# EasyEDA Pro project SSRC v1.eprj, schematic Schematic1_1
Board Name: PCB2; Create Date: 2025-12-02; Page Name: P1; Project Name: SSRC v1; Schematic Name: Schematic1_1; Update Date: 2025-12-05; Company: EasyEDA.com; Page Size: A4; Version: V1.0
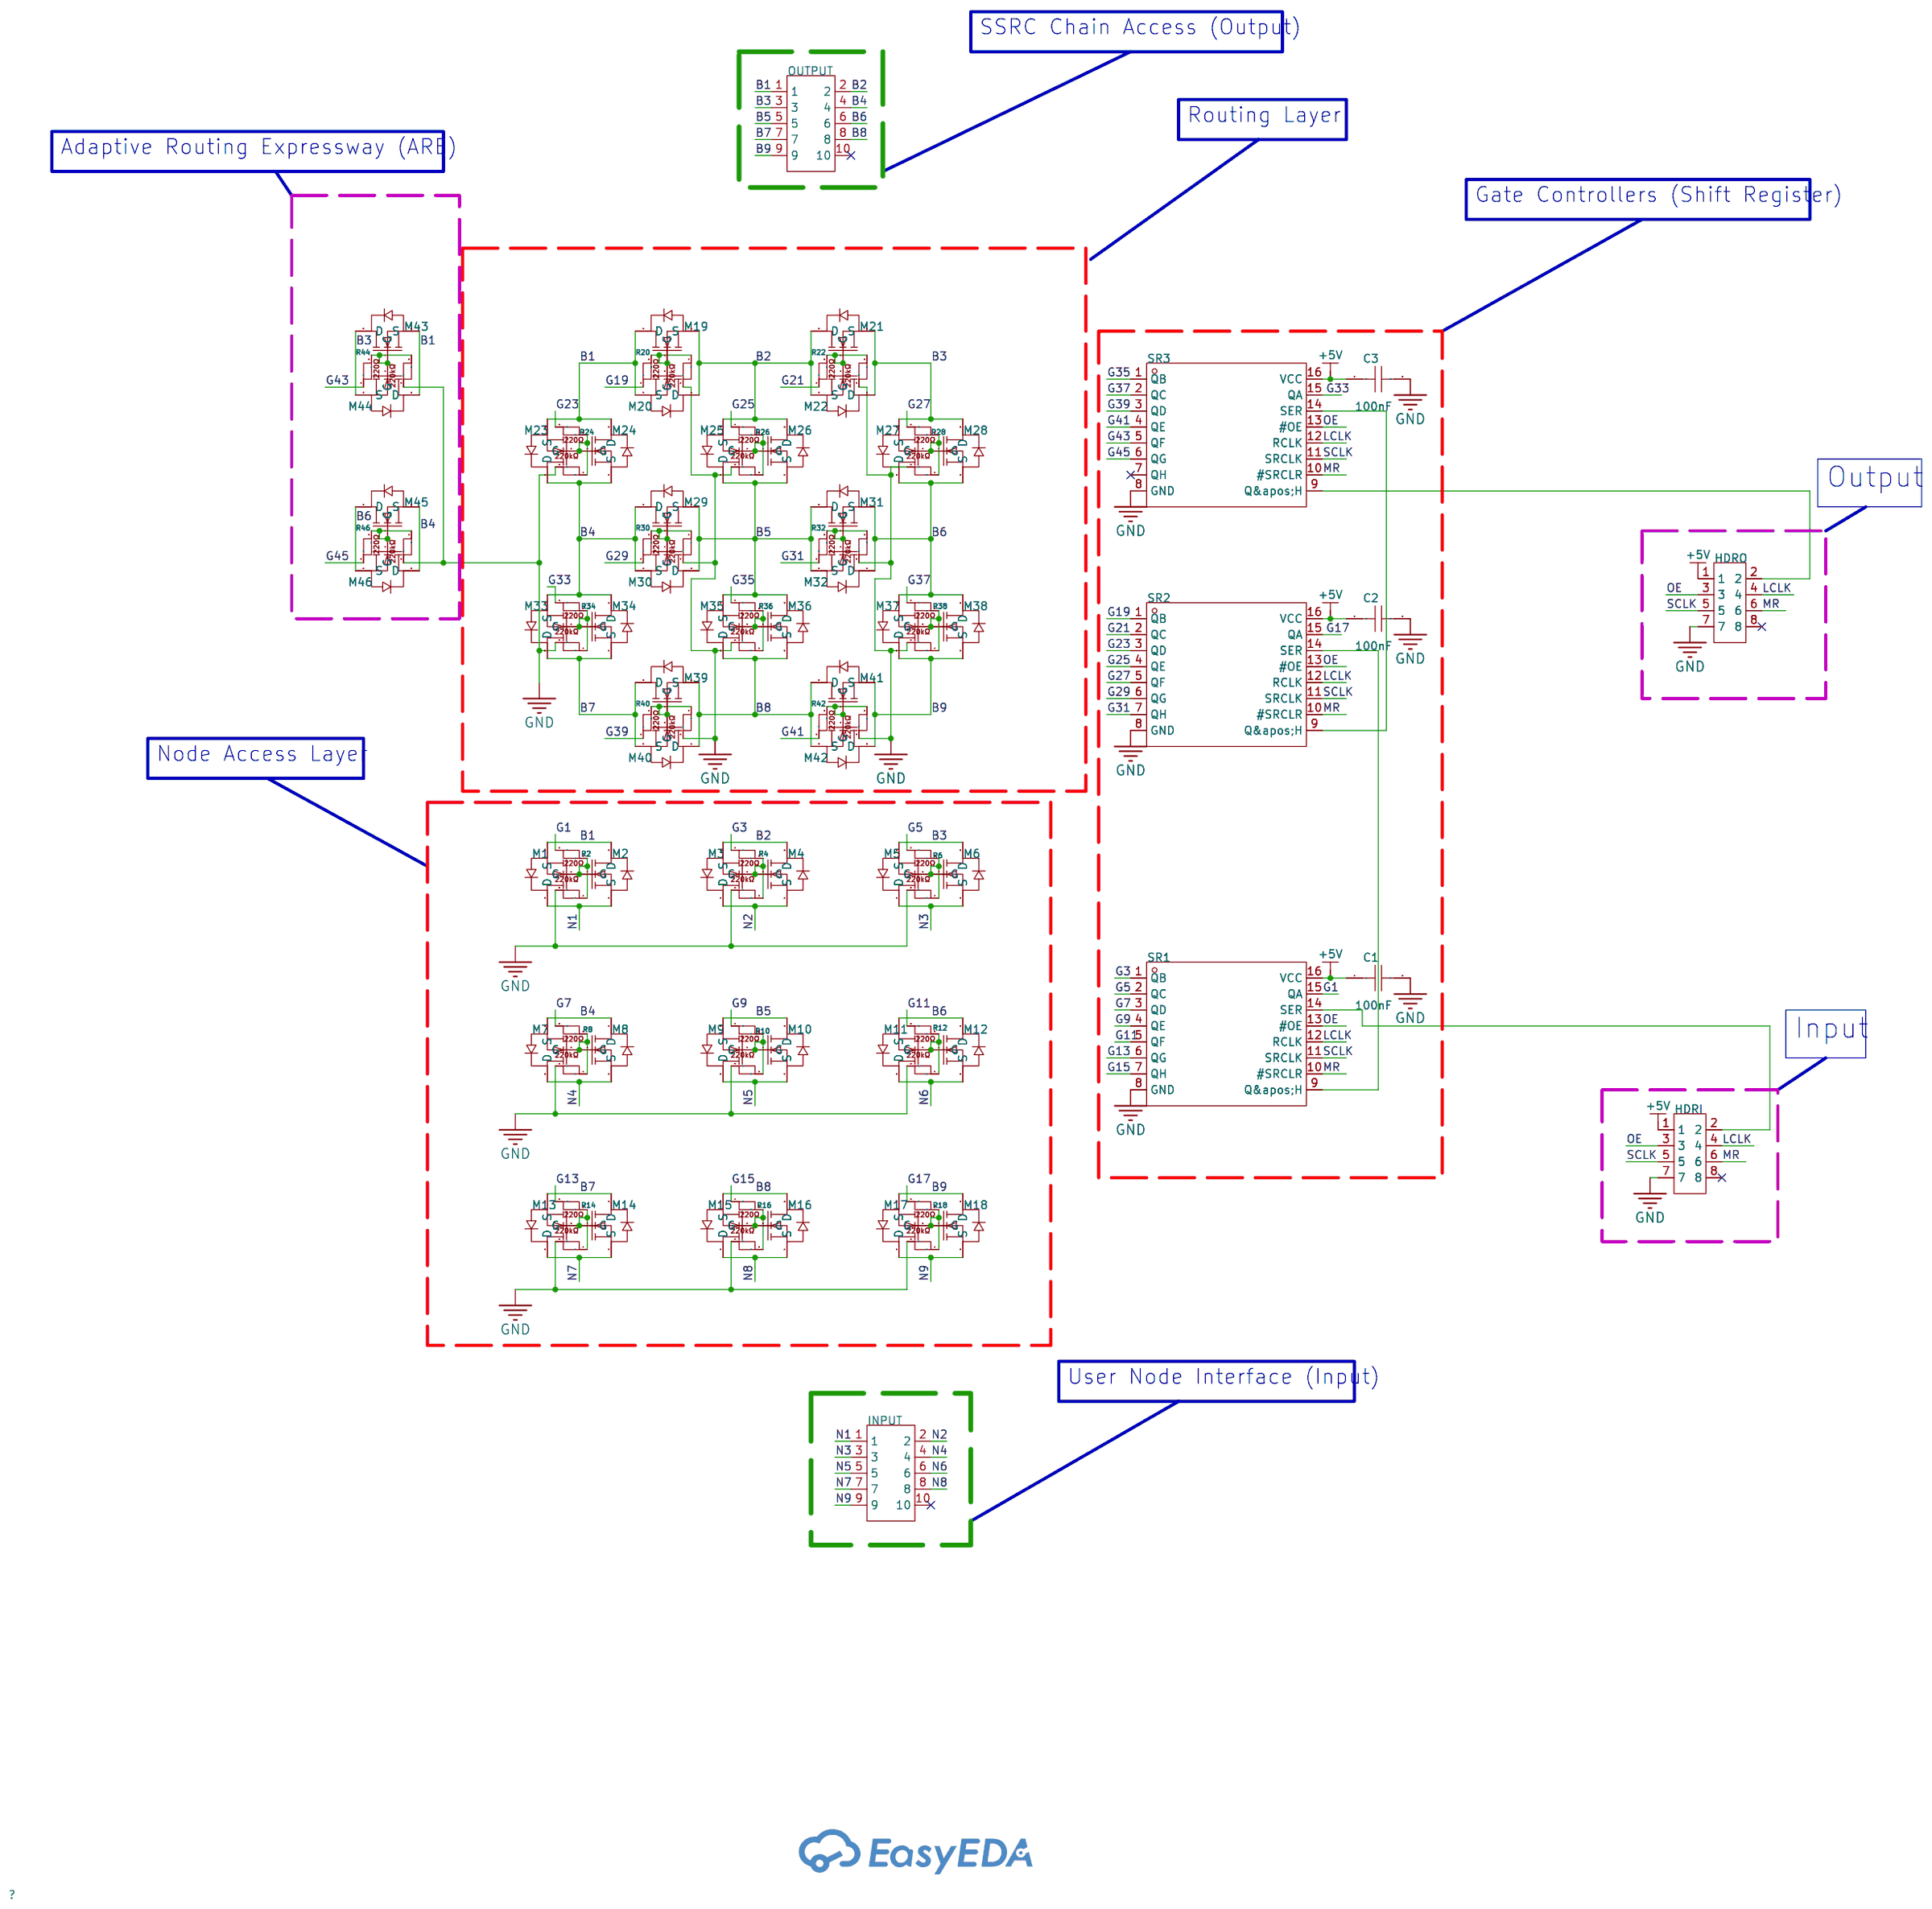
[diagram p1: schematic sheet]

## Parts
C1  100nF  [C0805]
C2  100nF  [C0805]
C3  100nF  [C0805]
HDRI  PZ254V-12-8P  [HDR-TH_8P-P2.54-V-M-R2-C4-S2.54]
HDRO  PZ254V-12-8P  [HDR-TH_8P-P2.54-V-M-R2-C4-S2.54]
INPUT  PZ254V-12-10P  [HDR-TH_10P-P2.54-V-M-R2-C5-S2.54]
M1  -  [SOT-23-3_L2.9-W1.3-P1.90-LS2.4-BR]
M2  -  [SOT-23-3_L2.9-W1.3-P1.90-LS2.4-BR]
M3  -  [SOT-23-3_L2.9-W1.3-P1.90-LS2.4-BR]
M4  -  [SOT-23-3_L2.9-W1.3-P1.90-LS2.4-BR]
M5  -  [SOT-23-3_L2.9-W1.3-P1.90-LS2.4-BR]
M6  -  [SOT-23-3_L2.9-W1.3-P1.90-LS2.4-BR]
M7  -  [SOT-23-3_L2.9-W1.3-P1.90-LS2.4-BR]
M8  -  [SOT-23-3_L2.9-W1.3-P1.90-LS2.4-BR]
M9  -  [SOT-23-3_L2.9-W1.3-P1.90-LS2.4-BR]
M10  -  [SOT-23-3_L2.9-W1.3-P1.90-LS2.4-BR]
M11  -  [SOT-23-3_L2.9-W1.3-P1.90-LS2.4-BR]
M12  -  [SOT-23-3_L2.9-W1.3-P1.90-LS2.4-BR]
M13  -  [SOT-23-3_L2.9-W1.3-P1.90-LS2.4-BR]
M14  -  [SOT-23-3_L2.9-W1.3-P1.90-LS2.4-BR]
M15  -  [SOT-23-3_L2.9-W1.3-P1.90-LS2.4-BR]
M16  -  [SOT-23-3_L2.9-W1.3-P1.90-LS2.4-BR]
M17  -  [SOT-23-3_L2.9-W1.3-P1.90-LS2.4-BR]
M18  -  [SOT-23-3_L2.9-W1.3-P1.90-LS2.4-BR]
M19  -  [SOT-23-3_L2.9-W1.3-P1.90-LS2.4-BR]
M20  -  [SOT-23-3_L2.9-W1.3-P1.90-LS2.4-BR]
M21  -  [SOT-23-3_L2.9-W1.3-P1.90-LS2.4-BR]
M22  -  [SOT-23-3_L2.9-W1.3-P1.90-LS2.4-BR]
M23  -  [SOT-23-3_L2.9-W1.3-P1.90-LS2.4-BR]
M24  -  [SOT-23-3_L2.9-W1.3-P1.90-LS2.4-BR]
M25  -  [SOT-23-3_L2.9-W1.3-P1.90-LS2.4-BR]
M26  -  [SOT-23-3_L2.9-W1.3-P1.90-LS2.4-BR]
M27  -  [SOT-23-3_L2.9-W1.3-P1.90-LS2.4-BR]
M28  -  [SOT-23-3_L2.9-W1.3-P1.90-LS2.4-BR]
M29  -  [SOT-23-3_L2.9-W1.3-P1.90-LS2.4-BR]
M30  -  [SOT-23-3_L2.9-W1.3-P1.90-LS2.4-BR]
M31  -  [SOT-23-3_L2.9-W1.3-P1.90-LS2.4-BR]
M32  -  [SOT-23-3_L2.9-W1.3-P1.90-LS2.4-BR]
M33  -  [SOT-23-3_L2.9-W1.3-P1.90-LS2.4-BR]
M34  -  [SOT-23-3_L2.9-W1.3-P1.90-LS2.4-BR]
M35  -  [SOT-23-3_L2.9-W1.3-P1.90-LS2.4-BR]
M36  -  [SOT-23-3_L2.9-W1.3-P1.90-LS2.4-BR]
M37  -  [SOT-23-3_L2.9-W1.3-P1.90-LS2.4-BR]
M38  -  [SOT-23-3_L2.9-W1.3-P1.90-LS2.4-BR]
M39  -  [SOT-23-3_L2.9-W1.3-P1.90-LS2.4-BR]
M40  -  [SOT-23-3_L2.9-W1.3-P1.90-LS2.4-BR]
M41  -  [SOT-23-3_L2.9-W1.3-P1.90-LS2.4-BR]
M42  -  [SOT-23-3_L2.9-W1.3-P1.90-LS2.4-BR]
M43  -  [SOT-23-3_L2.9-W1.3-P1.90-LS2.4-BR]
M44  -  [SOT-23-3_L2.9-W1.3-P1.90-LS2.4-BR]
M45  -  [SOT-23-3_L2.9-W1.3-P1.90-LS2.4-BR]
M46  -  [SOT-23-3_L2.9-W1.3-P1.90-LS2.4-BR]
OUTPUT  PZ254V-12-10P  [HDR-TH_10P-P2.54-V-M-R2-C5-S2.54]
R1  -  [RC1206FR-07220KL]
R2  -  [RC1206FR-1022RL]
R3  -  [RC1206FR-07220KL]
R4  -  [RC1206FR-1022RL]
R5  -  [RC1206FR-07220KL]
R6  -  [RC1206FR-1022RL]
R7  -  [RC1206FR-07220KL]
R8  -  [RC1206FR-1022RL]
R9  -  [RC1206FR-07220KL]
R10  -  [RC1206FR-1022RL]
R11  -  [RC1206FR-07220KL]
R12  -  [RC1206FR-1022RL]
R13  -  [RC1206FR-07220KL]
R14  -  [RC1206FR-1022RL]
R15  -  [RC1206FR-07220KL]
R16  -  [RC1206FR-1022RL]
R17  -  [RC1206FR-07220KL]
R18  -  [RC1206FR-1022RL]
R19  -  [RC1206FR-07220KL]
R20  -  [RC1206FR-1022RL]
R21  -  [RC1206FR-07220KL]
R22  -  [RC1206FR-1022RL]
R23  -  [RC1206FR-07220KL]
R24  -  [RC1206FR-1022RL]
R25  -  [RC1206FR-07220KL]
R26  -  [RC1206FR-1022RL]
R27  -  [RC1206FR-07220KL]
R28  -  [RC1206FR-1022RL]
R29  -  [RC1206FR-07220KL]
R30  -  [RC1206FR-1022RL]
R31  -  [RC1206FR-07220KL]
R32  -  [RC1206FR-1022RL]
R33  -  [RC1206FR-07220KL]
R34  -  [RC1206FR-1022RL]
R35  -  [RC1206FR-07220KL]
R36  -  [RC1206FR-1022RL]
R37  -  [RC1206FR-07220KL]
R38  -  [RC1206FR-1022RL]
R39  -  [RC1206FR-07220KL]
R40  -  [RC1206FR-1022RL]
R41  -  [RC1206FR-07220KL]
R42  -  [RC1206FR-1022RL]
R43  -  [RC1206FR-07220KL]
R44  -  [RC1206FR-1022RL]
R45  -  [RC1206FR-07220KL]
R46  -  [RC1206FR-1022RL]
SR1  SN74HC595NSR  [SOP-16_L10.3-W5.4-P1.27-LS7.8-BL]
SR2  SN74HC595NSR  [SOP-16_L10.3-W5.4-P1.27-LS7.8-BL]
SR3  SN74HC595NSR  [SOP-16_L10.3-W5.4-P1.27-LS7.8-BL]

## Library data of the parts
C1-C3 = CC0805KRX7R9BB104: LCSC Part Name: 100nF ±10% 50V; Supplier Part: C49678; Manufacturer: YAGEO(国巨); Supplier Footprint: 0805; JLCPCB Part Class: Basic Part; Datasheet: https://item.szlcsc.com/datasheet/CC0805KRX7R9BB104/50686.html; Supplier: LCSC; Tolerance: ±10%; Voltage Rating: 50V; Temperature Coefficient: X7R
HDRI HDRO = PZ254V-12-8P: LCSC Part Name: 2x4P 间距:2.54mm 方针 直插; Supplier Part: C492421; Manufacturer: XFCN(兴飞); Supplier Footprint: 插件,P=2.54mm; JLCPCB Part Class: Extended Part; Datasheet: https://item.szlcsc.com/datasheet/PZ254V-12-8P/502977.html; Supplier: LCSC; Pin Structure: 2x4P; Pitch: 2.54mm; Row Spacing: 2.54mm; Circluar Pins/Square Pins: Pin Header; Mounting Type: Through Hole; Number of Rows: 2; Number of Pins: 8P; Length of Mating Pin: 6mm; Insulation Height: 2.5mm; Length of End Connection Pin: 3mm; Contact Material: Brass; Operating Temperature: -40℃~+105℃; Color: Black
INPUT OUTPUT = PZ254V-12-10P: LCSC Part Name: 2x5P 间距:2.54mm 方针 直插; Supplier Part: C492422; Manufacturer: XFCN(兴飞); Supplier Footprint: 插件,P=2.54mm; JLCPCB Part Class: Extended Part; Datasheet: https://item.szlcsc.com/datasheet/PZ254V-12-10P/502978.html; Supplier: LCSC; Pin Structure: 2x5P; Pitch: 2.54mm; Row Spacing: 2.54mm; Circluar Pins/Square Pins: Pin Header; Mounting Type: Through Hole; Number of Rows: 2; Number of Pins: 10P; Length of Mating Pin: 6mm; Insulation Height: 2.5mm; Length of End Connection Pin: 3mm; Contact Material: Brass; Operating Temperature: -40℃~+105℃; Color: Black
M1-M46 = AO3400A_N: Supplier Footprint: SOT-23; Supplier Part: C700953; Type: 1个NChannel; Drain Source On Resistance (RDS(on)@Vgs,Id): 35mΩ@10V,5A; Gate Threshold Voltage (Vgs(th)@Id): 1.5V@250uA
R1 R3 R5 R7 R9 R11 R13 R15 R17 R19 R21 R23 R25 R27 R29 R31 R33 R35 R37 R39 R41 R43 R45 = RC1206FR-07220KL
R2 R4 R6 R8 R10 R12 R14 R16 R18 R20 R22 R24 R26 R28 R30 R32 R34 R36 R38 R40 R42 R44 R46 = RC1206FR-10220RL (mini schem)
SR1-SR3 = SN74HC595NSR: LCSC Part Name: 三态输出 8位串行至串行或并行移位寄存器; Supplier Part: C191873; Manufacturer: TI(德州仪器); Supplier Footprint: SOP-16-208mil; JLCPCB Part Class: Extended Part; Datasheet: https://www.ti.com/cn/lit/gpn/sn74hc595; Supplier: LCSC; Function: Serial-to-Serial or Parallel; Voltage - Supply: 2V~6V; Clock Frequency: 29MHz; Number of Bits per Element: 8; Output Type: Tri-State; Series: 74HC; Operating Temperature: -40℃~+85℃; Propagation Delay: 27ns@6V,50pF; Output Current: 6mA

## Nets
+5V: C1.1 C2.1 C3.1 HDRI.1 HDRO.1 SR1.16(VCC) SR2.16(VCC) SR3.16(VCC)
GND: C1.2 C2.2 C3.2 HDRI.7 HDRO.7 R1.2(1) R3.2(1) R5.2(1) R7.2(1) R9.2(1) R11.2(1) R13.2(1) R15.2(1) R17.2(1) R19.2(1) R21.2(1) R23.2(1) R25.2(1) R27.2(1) R29.2(1) R31.2(1) R33.2(1) R35.2(1) R37.2(1) R39.2(1) R41.2(1) R43.2(1) R45.2(1) SR1.8(GND) SR2.8(GND) SR3.8(GND)
B1: M1.2(S) M2.3(D) M19.3(D) M20.2(S) M23.2(S) M24.3(D) M43.2(S) M44.3(D) OUTPUT.1
B2: M3.2(S) M4.3(D) M19.2(S) M20.3(D) M21.3(D) M22.2(S) M25.2(S) M26.3(D) OUTPUT.2
B3: M5.2(S) M6.3(D) M21.2(S) M22.3(D) M27.2(S) M28.3(D) M43.3(D) M44.2(S) OUTPUT.3
B4: M7.2(S) M8.3(D) M23.3(D) M24.2(S) M29.3(D) M30.2(S) M33.2(S) M34.3(D) M45.2(S) M46.3(D) OUTPUT.4
B5: M9.2(S) M10.3(D) M25.3(D) M26.2(S) M29.2(S) M30.3(D) M31.3(D) M32.2(S) M35.2(S) M36.3(D) OUTPUT.5
B6: M11.2(S) M12.3(D) M27.3(D) M28.2(S) M31.2(S) M32.3(D) M37.2(S) M38.3(D) M45.3(D) M46.2(S) OUTPUT.6
B7: M13.2(S) M14.3(D) M33.3(D) M34.2(S) M39.3(D) M40.2(S) OUTPUT.7
B8: M15.2(S) M16.3(D) M35.3(D) M36.2(S) M39.2(S) M40.3(D) M41.3(D) M42.2(S) OUTPUT.8
B9: M17.2(S) M18.3(D) M37.3(D) M38.2(S) M41.2(S) M42.3(D) OUTPUT.9
G1: R2.1 SR1.15(QA)
G3: R4.1 SR1.1(QB)
G5: R6.1 SR1.2(QC)
G7: R8.1 SR1.3(QD)
G9: R10.1 SR1.4(QE)
G11: R12.1 SR1.5(QF)
G13: R14.1 SR1.6(QG)
G15: R16.1 SR1.7(QH)
G17: R18.1 SR2.15(QA)
G19: R20.1 SR2.1(QB)
G21: R22.1 SR2.2(QC)
G23: R24.1 SR2.3(QD)
G25: R26.1 SR2.4(QE)
G27: R28.1 SR2.5(QF)
G29: R30.1 SR2.6(QG)
G31: R32.1 SR2.7(QH)
G33: R34.1 SR3.15(QA)
G35: R36.1 SR3.1(QB)
G37: R38.1 SR3.2(QC)
G39: R40.1 SR3.3(QD)
G41: R42.1 SR3.4(QE)
G43: R44.1 SR3.5(QF)
G45: R46.1 SR3.6(QG)
LCLK: HDRI.4 HDRO.4 SR1.12(RCLK) SR2.12(RCLK) SR3.12(RCLK)
MR: HDRI.6 HDRO.6 SR1.10(#SRCLR) SR2.10(#SRCLR) SR3.10(#SRCLR)
N1: INPUT.1 M1.3(D) M2.2(S)
N2: INPUT.2 M3.3(D) M4.2(S)
N3: INPUT.3 M5.3(D) M6.2(S)
N4: INPUT.4 M7.3(D) M8.2(S)
N5: INPUT.5 M9.3(D) M10.2(S)
N6: INPUT.6 M11.3(D) M12.2(S)
N7: INPUT.7 M13.3(D) M14.2(S)
N8: INPUT.8 M15.3(D) M16.2(S)
N9: INPUT.9 M17.3(D) M18.2(S)
OE: HDRI.3 HDRO.3 SR1.13(#OE) SR2.13(#OE) SR3.13(#OE)
SCLK: HDRI.5 HDRO.5 SR1.11(SRCLK) SR2.11(SRCLK) SR3.11(SRCLK)
$1N322: M25.1(G) M26.1(G) R25.1 R26.2(1)
$1N1509: M41.1(G) M42.1(G) R41.1 R42.2(1)
$1N1583: M39.1(G) M40.1(G) R39.1 R40.2(1)
$1N1657: M33.1(G) M34.1(G) R33.1 R34.2(1)
$1N1731: M23.1(G) M24.1(G) R23.1 R24.2(1)
$1N4820: M1.1(G) M2.1(G) R1.1 R2.2(1)
$1N4826: M3.1(G) M4.1(G) R3.1 R4.2(1)
$1N4832: M5.1(G) M6.1(G) R5.1 R6.2(1)
$1N4838: M7.1(G) M8.1(G) R7.1 R8.2(1)
$1N4844: M9.1(G) M10.1(G) R9.1 R10.2(1)
$1N4850: M11.1(G) M12.1(G) R11.1 R12.2(1)
$1N4856: M13.1(G) M14.1(G) R13.1 R14.2(1)
$1N4862: M15.1(G) M16.1(G) R15.1 R16.2(1)
$1N4868: M17.1(G) M18.1(G) R17.1 R18.2(1)
$1N10938: M27.1(G) M28.1(G) R27.1 R28.2(1)
$1N10996: M19.1(G) M20.1(G) R19.1 R20.2(1)
$1N11052: M21.1(G) M22.1(G) R21.1 R22.2(1)
$1N11108: M29.1(G) M30.1(G) R29.1 R30.2(1)
$1N11164: M31.1(G) M32.1(G) R31.1 R32.2(1)
$1N11220: M35.1(G) M36.1(G) R35.1 R36.2(1)
$1N11276: M37.1(G) M38.1(G) R37.1 R38.2(1)
$1N19303: M43.1(G) M44.1(G) R43.1 R44.2(1)
$1N19419: M45.1(G) M46.1(G) R45.1 R46.2(1)
$1N32987: SR1.9(Q&apos;H) SR2.14(SER)
$1N32993: SR2.9(Q&apos;H) SR3.14(SER)
Net-(HDRI-2): HDRI.2 SR1.14(SER)
Net-(HDRO-2): HDRO.2 SR3.9(Q&apos;H)

Not connected (* = marked no-connect by the designer): HDRI 8*; HDRO 8*; INPUT 10*; OUTPUT 10*; SR3 7(QH)*

## Notes on the sheet
- SSRC Chain Access (Output)
- Routing Layer
- Adaptive Routing Expressway (ARE)
- Gate Controllers (Shift Register)
- Output
- Node Access Layer
- Input
- User Node Interface (Input)
